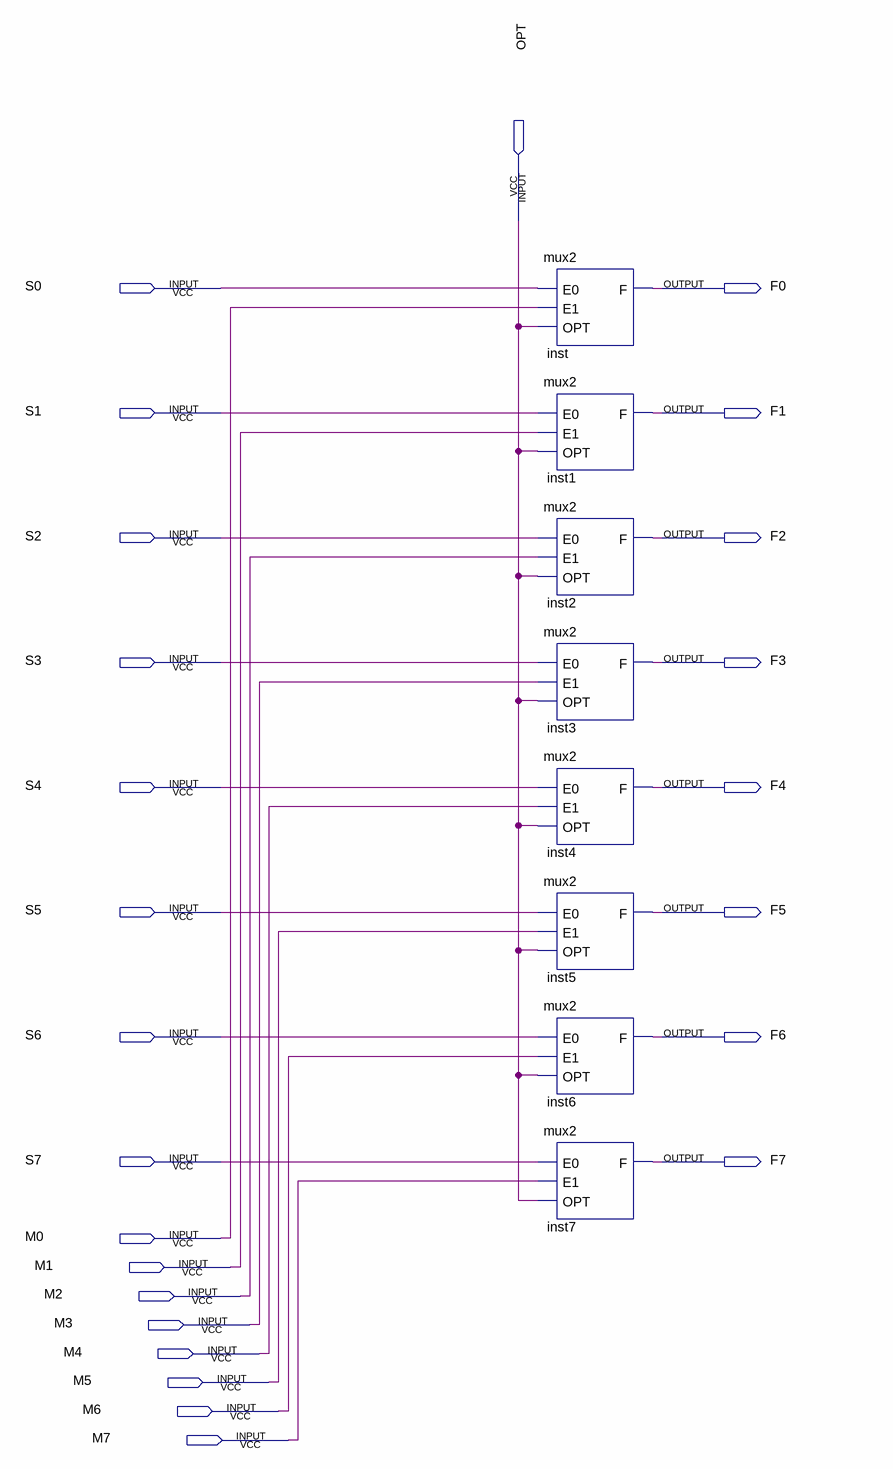
[diagram p0: schematic sheet]
// Quartus schematic muxS.bdf as structural Verilog: 8 symbols, 25 pins
module muxS (
  input  OPT,
  input  S0,
  input  S1,
  input  S2,
  input  S3,
  input  S4,
  input  S5,
  input  S6,
  input  S7,
  input  M0,
  input  M1,
  input  M2,
  input  M3,
  input  M4,
  input  M5,
  input  M6,
  input  M7,
  output F0,
  output F1,
  output F2,
  output F3,
  output F4,
  output F5,
  output F6,
  output F7
);

  mux2 inst (.E0(S0), .E1(M0), .OPT(OPT), .F(F0));
  mux2 inst1 (.E0(S1), .E1(M1), .OPT(OPT), .F(F1));
  mux2 inst2 (.E0(S2), .E1(M2), .OPT(OPT), .F(F2));
  mux2 inst3 (.E0(S3), .E1(M3), .OPT(OPT), .F(F3));
  mux2 inst4 (.E0(S4), .E1(M4), .OPT(OPT), .F(F4));
  mux2 inst5 (.E0(S5), .E1(M5), .OPT(OPT), .F(F5));
  mux2 inst6 (.E0(S6), .E1(M6), .OPT(OPT), .F(F6));
  mux2 inst7 (.E0(S7), .E1(M7), .OPT(OPT), .F(F7));
endmodule
